# Altium schematic sheet 5 - Power.SchDoc
size A3; PageSetup: Record=PageOptions|CenterHorizontal=True|CenterVertical=True|PrintScale=0.98|XCorrection=1.00|YCorrection=1.00|PrintKind=1|BorderSize=5000000|LeftOffset=0|BottomOffset=0|Orientation=2|PaperLength=1000|PaperWidth=1000|Scale=100|PaperSource=258|PrintQuality=600|MediaType=1|DitherType=10|PaperKind=A4|PrintScaleMode=1
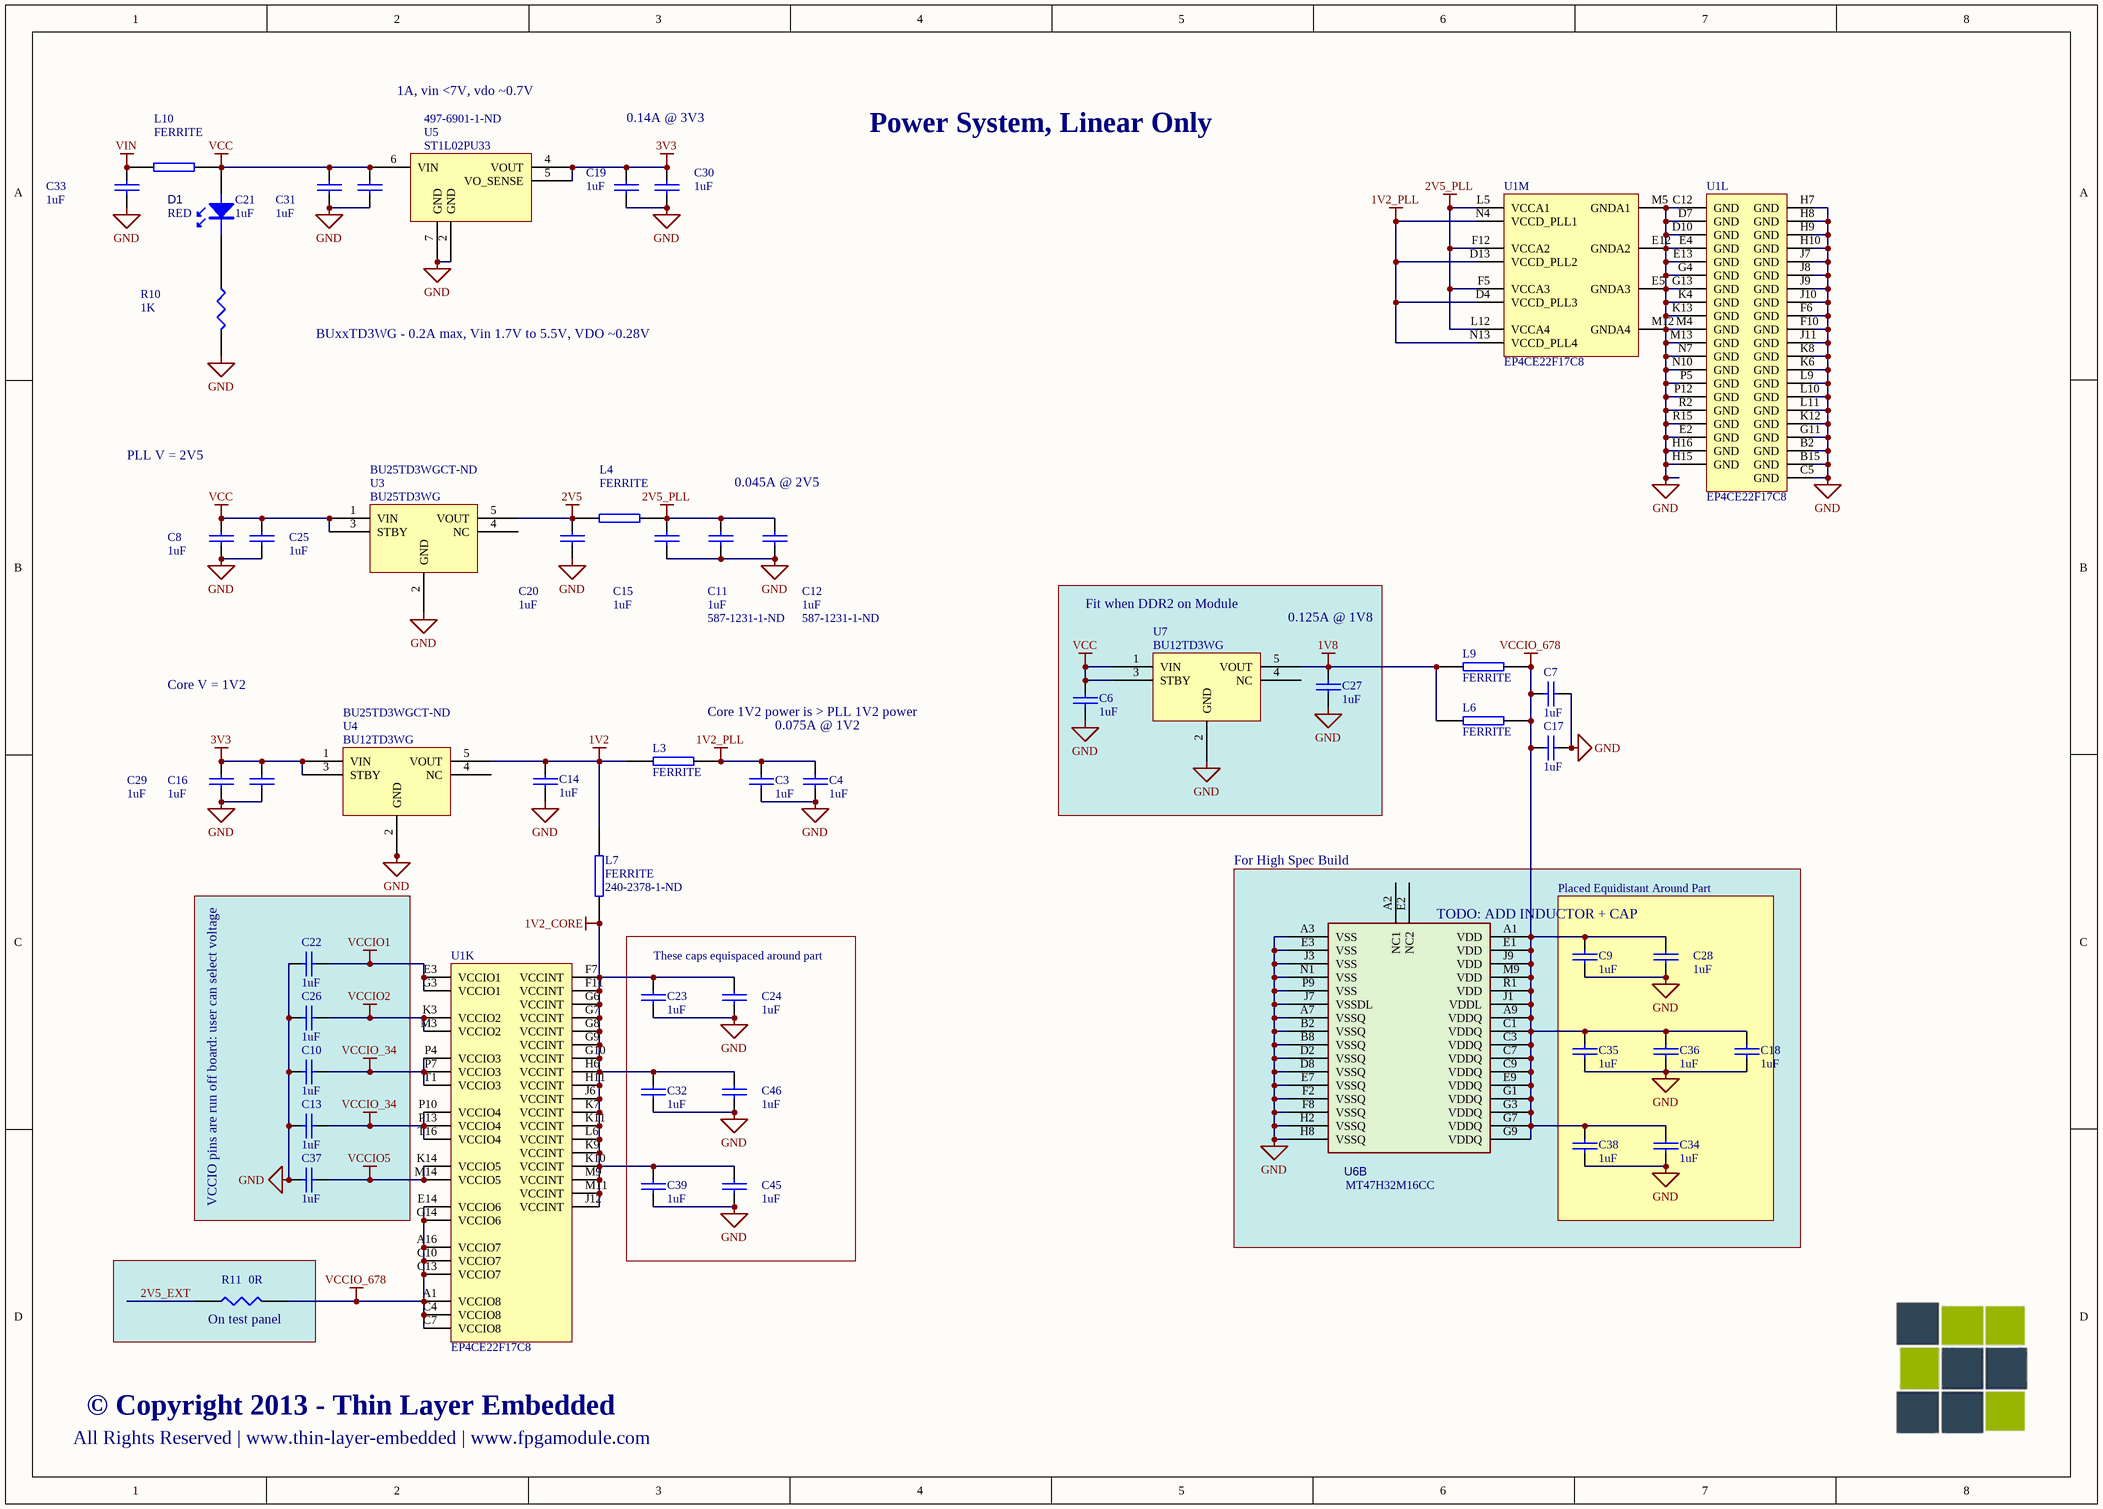
[diagram p0: 5 - Power.SchDoc]

## Parts
C3  1uF  [0402_HD]
C4  1uF  [0402_HD]
C6  1uF  [0402_HD]
C7  1uF  [0402_HD]
C8  1uF  [0402_HD]
C9  1uF  [0402_HD]
C10  1uF  [0402_HD]
C11  1uF  Supplier Part Number 2: 587-1231-1-ND  [0402_HD]
C12  1uF  Supplier Part Number 2: 587-1231-1-ND  [0402_HD]
C13  1uF  [0402_HD]
C14  1uF  [0402_HD]
C15  1uF  [0402_HD]
C16  1uF  [0402_HD]
C17  1uF  [0402_HD]
C18  1uF  [0402_HD]
C19  1uF  [0402_HD]
C20  1uF  [0402_HD]
C21  1uF  [0402_HD]
C22  1uF  [0402_HD]
C23  1uF  [0402_HD]
C24  1uF  [0402_HD]
C25  1uF  [0402_HD]
C26  1uF  [0402_HD]
C27  1uF  [0402_HD]
C28  1uF  [0402_HD]
C29  1uF  [0402_HD]
C30  1uF  [0402_HD]
C31  1uF  [0402_HD]
C32  1uF  [0402_HD]
C33  1uF  [0402_HD]
C34  1uF  [0402_HD]
C35  1uF  [0402_HD]
C36  1uF  [0402_HD]
C37  1uF  [0402_HD]
C38  1uF  [0402_HD]
C39  1uF  [0402_HD]
C45  1uF  [0402_HD]
C46  1uF  [0402_HD]
D1  RED  [0402LED_HD]
L3  FERRITE  [0402_HD]
L4  FERRITE  [0402_HD]
L6  FERRITE  [0402_HD]
L7  FERRITE  Supplier Part Number 1: 240-2378-1-ND  [0402_HD]
L9  FERRITE  [0402_HD]
L10  FERRITE  [0805]
R10  1K  [0402_HD]
R11  0R  [0402_HD]
U1  EP4CE22F17C8  [FBGA256]  (parts K,L,M of 13)
U3  BU25TD3WG  Supplier Part Number 1: BU25TD3WGCT-ND  [SSOP5]
U4  BU12TD3WG  Supplier Part Number 1: BU25TD3WGCT-ND  [SSOP5]
U5  ST1L02PU33  Supplier Part Number 1: 497-6901-1-ND  [DFN6]
U6  MT47H32M16CC  [DDR2_84_SPEC_HD]  (part B of 2)
U7  BU12TD3WG  [SSOP5]

## Blocks framed on the sheet
TODO: ADD INDUCTOR + CAP: U6
VCCIO pins are run off board: user can select voltage: C10 C13 C22 C26 C37
Placed Equidistant Around Part: C9 C18 C28 C34-C36 C38
These caps equispaced around part: C23 C24 C32 C39 C45 C46
On test panel: R11

## Nets
1V2: C14.1 L3.2 L7.1 U4.5(VOUT)
1V2_CORE: C23.1 C24.1 C32.1 C39.1 C45.1 C46.1 L7.2 U1.F7(VCCINT) U1.F11(VCCINT) U1.G6(VCCINT) U1.G7(VCCINT) U1.G8(VCCINT) U1.G9(VCCINT) U1.G10(VCCINT) U1.H6(VCCINT) U1.H11(VCCINT) U1.J6(VCCINT) U1.J12(VCCINT) U1.K7(VCCINT) U1.K9(VCCINT) U1.K10(VCCINT) U1.K11(VCCINT) U1.L6(VCCINT) U1.M9(VCCINT) U1.M11(VCCINT)
1V2_PLL: C3.1 C4.1 L3.1 U1.D4(VCCD_PLL3) U1.D13(VCCD_PLL2) U1.N4(VCCD_PLL1) U1.N13(VCCD_PLL4)
1V8: C27.1 L6.1 L9.1 U7.5(VOUT)
2V5: C20.2 L4.1 U3.5(VOUT)
2V5_PLL: C11.1 C12.1 C15.1 L4.2 U1.F5(VCCA3) U1.F12(VCCA2) U1.L5(VCCA1) U1.L12(VCCA4)
3V3: C16.1 C19.1 C29.1 C30.1 U4.1(VIN) U4.3(STBY) U5.4(VOUT) U5.5(VO_SENSE)
GND: C3.2 C4.2 C6.2 C7.2 C8.2 C9.2 C10.1 C11.2 C12.2 C13.1 C14.2 C15.2 C16.2 C17.2 C18.2 C19.2 C20.1 C21.2 C22.1 C23.2 C24.2 C25.2 C26.1 C27.2 C28.2 C29.2 C30.2 C31.2 C32.2 C33.1 C34.2 C35.2 C36.2 C37.1 C38.2 C39.2 C45.2 C46.2 R10.1 U1.B2(GND) U1.B15(GND) U1.C5(GND) U1.C12(GND) U1.D7(GND) U1.D10(GND) U1.E2(GND) U1.E4(GND) U1.E5(GNDA3) U1.E12(GNDA2) U1.E13(GND) U1.F6(GND) U1.F10(GND) U1.G4(GND) U1.G11(GND) U1.G13(GND) U1.H7(GND) U1.H8(GND) U1.H9(GND) U1.H10(GND) U1.H15(GND) U1.H16(GND) U1.J7(GND) U1.J8(GND) U1.J9(GND) U1.J10(GND) U1.J11(GND) U1.K4(GND) U1.K6(GND) U1.K8(GND) U1.K12(GND) U1.K13(GND) U1.L9(GND) U1.L10(GND) U1.L11(GND) U1.M4(GND) U1.M5(GNDA1) U1.M12(GNDA4) U1.M13(GND) U1.N7(GND) U1.N10(GND) U1.P5(GND) U1.P12(GND) U1.R2(GND) U1.R15(GND) U3.2(GND) U4.2(GND) U5.2(GND) U5.7(GND) U6.A3(VSS) U6.A7(VSSQ) U6.B2(VSSQ) U6.B8(VSSQ) U6.D2(VSSQ) U6.D8(VSSQ) U6.E3(VSS) U6.E7(VSSQ) U6.F2(VSSQ) U6.F8(VSSQ) U6.H2(VSSQ) U6.H8(VSSQ) U6.J3(VSS) U6.J7(VSSDL) U6.N1(VSS) U6.P9(VSS) U7.2(GND)
VCC: C6.1 C8.1 C21.1 C25.1 C31.1 D1.A L10.2 U3.1(VIN) U3.3(STBY) U5.6(VIN) U7.1(VIN) U7.3(STBY)
VCCIO1: C22.2 U1.E3(VCCIO1) U1.G3(VCCIO1)
VCCIO2: C26.2 U1.K3(VCCIO2) U1.M3(VCCIO2)
VCCIO5: C37.2 U1.K14(VCCIO5) U1.M14(VCCIO5)
VCCIO_34: C10.2 C13.2 U1.P4(VCCIO3) U1.P7(VCCIO3) U1.P10(VCCIO4) U1.P13(VCCIO4) U1.T1(VCCIO3) U1.T16(VCCIO4)
VCCIO_678: C7.1 C9.1 C17.1 C18.1 C28.1 C34.1 C35.1 C36.1 C38.1 L6.2 L9.2 R11.1 U1.A1(VCCIO8) U1.A16(VCCIO7) U1.C4(VCCIO8) U1.C7(VCCIO8) U1.C10(VCCIO7) U1.C13(VCCIO7) U1.E14(VCCIO6) U1.G14(VCCIO6) U6.A1(VDD) U6.A9(VDDQ) U6.C1(VDDQ) U6.C3(VDDQ) U6.C7(VDDQ) U6.C9(VDDQ) U6.E1(VDD) U6.E9(VDDQ) U6.G1(VDDQ) U6.G3(VDDQ) U6.G7(VDDQ) U6.G9(VDDQ) U6.J1(VDDL) U6.J9(VDD) U6.M9(VDD) U6.R1(VDD)
VIN: C33.2 L10.1
2V5_EXT: R11.2
NetD1_K: D1.K R10.2

Not connected (* = marked no-connect by the designer): U3 4(NC); U4 4(NC); U6 A2(NC1) E2(NC2); U7 4(NC)

## Notes on the sheet
- 1A, vin <7V, vdo ~0.7V
- 0.14A @ 3V3
- Power System, Linear Only
- BUxxTD3WG - 0.2A max, Vin 1.7V to 5.5V, VDO ~0.28V
- PLL V = 2V5
- 0.045A @ 2V5
- Fit when DDR2 on Module
- 0.125A @ 1V8
- Core V = 1V2
- Core 1V2 power is > PLL 1V2 power
- 0.075A @ 1V2
- For High Spec Build
- All Rights Reserved | www.thin-layer-embedded | www.fpgamodule.com
- © Copyright 2013 - Thin Layer Embedded

## Library data of the parts
C3 C4 C6-C39 C45 C46 = CAP: Capacitor; Supplier 1: Digi-Key; Supplier Part Number 1: 587-1231-2-ND
  C11 C12: Supplier 2: Digi-Key
D1 = LED
L4 = FERRITE: Current Rating: 300mA; DC Resistance (DCR): 300 mOhm Max; Category: Filters; ComponentLink1URL: http://www.yuden.co.jp/us/product/pdf/mlci07_e.pdf; ComponentLink1Description: http://www.yuden.co.jp/us/product/pdf/mlci07_e.pdf
L7 = FERRITE: Manufacturer: Laird-Signal Integrity Products; Manufacturer Part Number: HZ0603B102R-10; Description: FERRITE 200MA 1000 OHM 0603 SMD; Impedance @ Frequency: 1K Ohm @ 100MHz; Current Rating: 200mA; DC Resistance (DCR): 600 mOhm Max; Filter Type: Differential Mode - Single; Number of Lines: 1; Supplier 1: Digi-Key; RoHS: RoHS Compliant; Category: Filters; Stock 1: 918950; Pricing 1: 10=0.063, 50=0.0542, 100=0.0501, 250=0.04176, 500=0.03758, 1000=0.0334 (USD); Package / Case: 0603 (1608 Metric); Mounting Type: Surface Mount; Packaging: Cut Tape (CT); ComponentLink1URL: http://www.steward.com/view_print.asp?St_PartNo=HZ0603B102R-10; ComponentLink1Description: http://www.steward.com/view_print.asp?St_PartNo=HZ0603B102R-10; Supplier Part Number 1: 587-1231-2-ND
R10 = RES1: Supplier 1: Digi-Key; Supplier Part Number 1: P1.0KJCT-ND; Supplier Part Number 1: 587-1231-2-ND
R11 = RES1: Manufacturer: Yageo; Manufacturer Part Number: RC0402FR-0724R9L; Description: RES 24.9 OHM 1/16W 1% 0402 SMD; Resistance (Ohms): 24.9; Power (Watts): 0.063W, 1/16W; Temperature Coefficient: ±100ppm/°C; Tolerance: ±1%; Supplier 1: Digi-Key; RoHS: RoHS Compliant; Category: Resistors; Stock 1: 237555; Pricing 1: 10=0.014, 50=0.0104, 100=0.0079, 250=0.00584, 500=0.00432, 1000=0.00288 (USD); Composition: Thick Film; Features: -; Size / Dimension: 0.039" L x 0.020" W (1.00mm x 0.50mm); Height: 0.014" (0.35mm); Number of Terminations: 2; Packaging: Cut Tape (CT); Package / Case: 0402 (1005 Metric); ComponentLink1URL: http://www.yageo.com/documents/recent/PYu-RC0402_51_RoHS_L_6.pdf; ComponentLink1Description: http://www.yageo.com/documents/recent/PYu-RC0402_51_RoHS_L_6.pdf; Supplier 2: Digi-Key; Stock 2: 302870; Pricing 2: 10=0.014, 50=0.0104, 100=0.0079, 250=0.00584, 500=0.00432, 1000=0.00288 (USD); ComponentLink2URL: http://www.yageo.com/documents/recent/PYu-RC0603_51_RoHS_L_4.pdf; ComponentLink2Description: http://www.yageo.com/documents/recent/PYu-RC0603_51_RoHS_L_4.pdf
U1 = EP4CE22F17C8: Cyclone IV Family FPGA, 2V Core, 153 I/O Pins, 4 PLLs, 256-Pin FBGA, Speed Grade 8, Commercial Grade; Published: 3-May-2010; DatasheetVersion: ver1.2, Mar-2010; PackageVersion: ver16.0, Dec-2009; PackageReference: FBGA256; Publisher: Altium Limited; PackageDescription: 256-Ball FineLine Ball Grid Array (FBGA256) - Option 1 - Wire Bond; Code_JEDEC: MS-034-AAF-1; Code_IPC: BGA100P16X16-256; ComponentLink1Description: Manufacturer Link; ComponentLink1URL: http://www.altera.com/; ComponentLink2Description: Handbook; ComponentLink2URL: http://www.altera.com/literature/hb/cyclone-iv/cyclone4-handbook.pdf; ComponentLink3Description: Pinout Specification; ComponentLink3URL: http://www.altera.com/literature/lit-dp.jsp?category=cyc%204&showspreadsheet=y; ComponentLink4Description: Packaging Specification; ComponentLink4URL: http://www.altera.com/literature/ds/dspkg.pdf
U3 U4 = BU12TD3WG: Manufacturer: Rohm Semiconductor; Manufacturer Part Number: BU25TD3WG-TR; Description: IC REG LDO 2.5V 0.2A 5SSOP; Regulator Topology: Positive Fixed; Voltage - Output: 2.5V; Voltage - Input: Up to 5.5V; Voltage - Dropout (Typical): 0.28V @ 200mA; Number of Regulators: 1; Current - Output: 200mA (Max); Current - Limit (Min): 220mA; Supplier 1: Digi-Key; RoHS: RoHS Compliant; Category: Integrated Circuits (ICs); Stock 1: 6000; Pricing 1: 1=0.5, 25=0.3484, 100=0.2987, 250=0.25792, 500=0.22172, 1000=0.17195 (USD); Operating Temperature: -40°C ~ 85°C; Mounting Type: Surface Mount; Package / Case: 6-LSOP (0.063", 1.60mm Width) 5 Leads; Supplier Device Package: 5-SSOP; Packaging: Cut Tape (CT); ComponentLink1URL: http://www.rohm.com/products/databook/power/pdf/buxxtd3wg-e.pdf; ComponentLink1Description: http://www.rohm.com/products/databook/power/pdf/buxxtd3wg-e.pdf; Supplier Part Number 1: 587-1231-2-ND
U5 = ST1L02PU33: Manufacturer: STMicroelectronics; Manufacturer Part Number: ST1L02PU33R; Description: IC VREG LDO 1A 3.3V DFN-6D; Regulator Topology: Positive Fixed; Voltage - Output: 3.3V; Voltage - Input: 4.5 V ~ 7 V; Voltage - Dropout (Typical): 0.7V @ 1A; Number of Regulators: 1; Current - Output: 1A; Supplier 1: Digi-Key; RoHS: RoHS Compliant; Category: Integrated Circuits (ICs); Stock 1: 2795; Pricing 1: 1=1.8, 10=1.608, 100=1.2771, 250=1.11156, 500=0.9933, 1000=0.78045 (USD); Current - Limit (Min): 1A; Operating Temperature: 0°C ~ 125°C; Mounting Type: Surface Mount; Package / Case: 6-VDFN Exposed Pad; Supplier Device Package: 6-DFN (3x3); Packaging: Cut Tape (CT); ComponentLink1URL: http://www.st.com/internet/com/TECHNICAL_RESOURCES/TECHNICAL_LITERATURE/DATASHEET/CD00050492.pdf; ComponentLink1Description: http://www.st.com/internet/com/TECHNICAL_RESOURCES/TECHNICAL_LITERATURE/DATASHEET/CD00050492.pdf; Supplier Part Number 1: 587-1231-2-ND
U6 = MT47H32M16CC: IC DDR2 SDRAM 32M X 16 4 BANKS 333MHZ CAS LATENCY 5 FBGA PACKAGE 84 PINS 1.8V CORE 1.8V IO; Manufacturer Part Num: MT47H32M16CC-3:B; Manufacturer: Micron; Item Num: P01-13045R; Manufacturer's Part No.: MT47H32M16CC-3:B